# EAGLE schematic motor_power_avr (EAGLE 4.16)
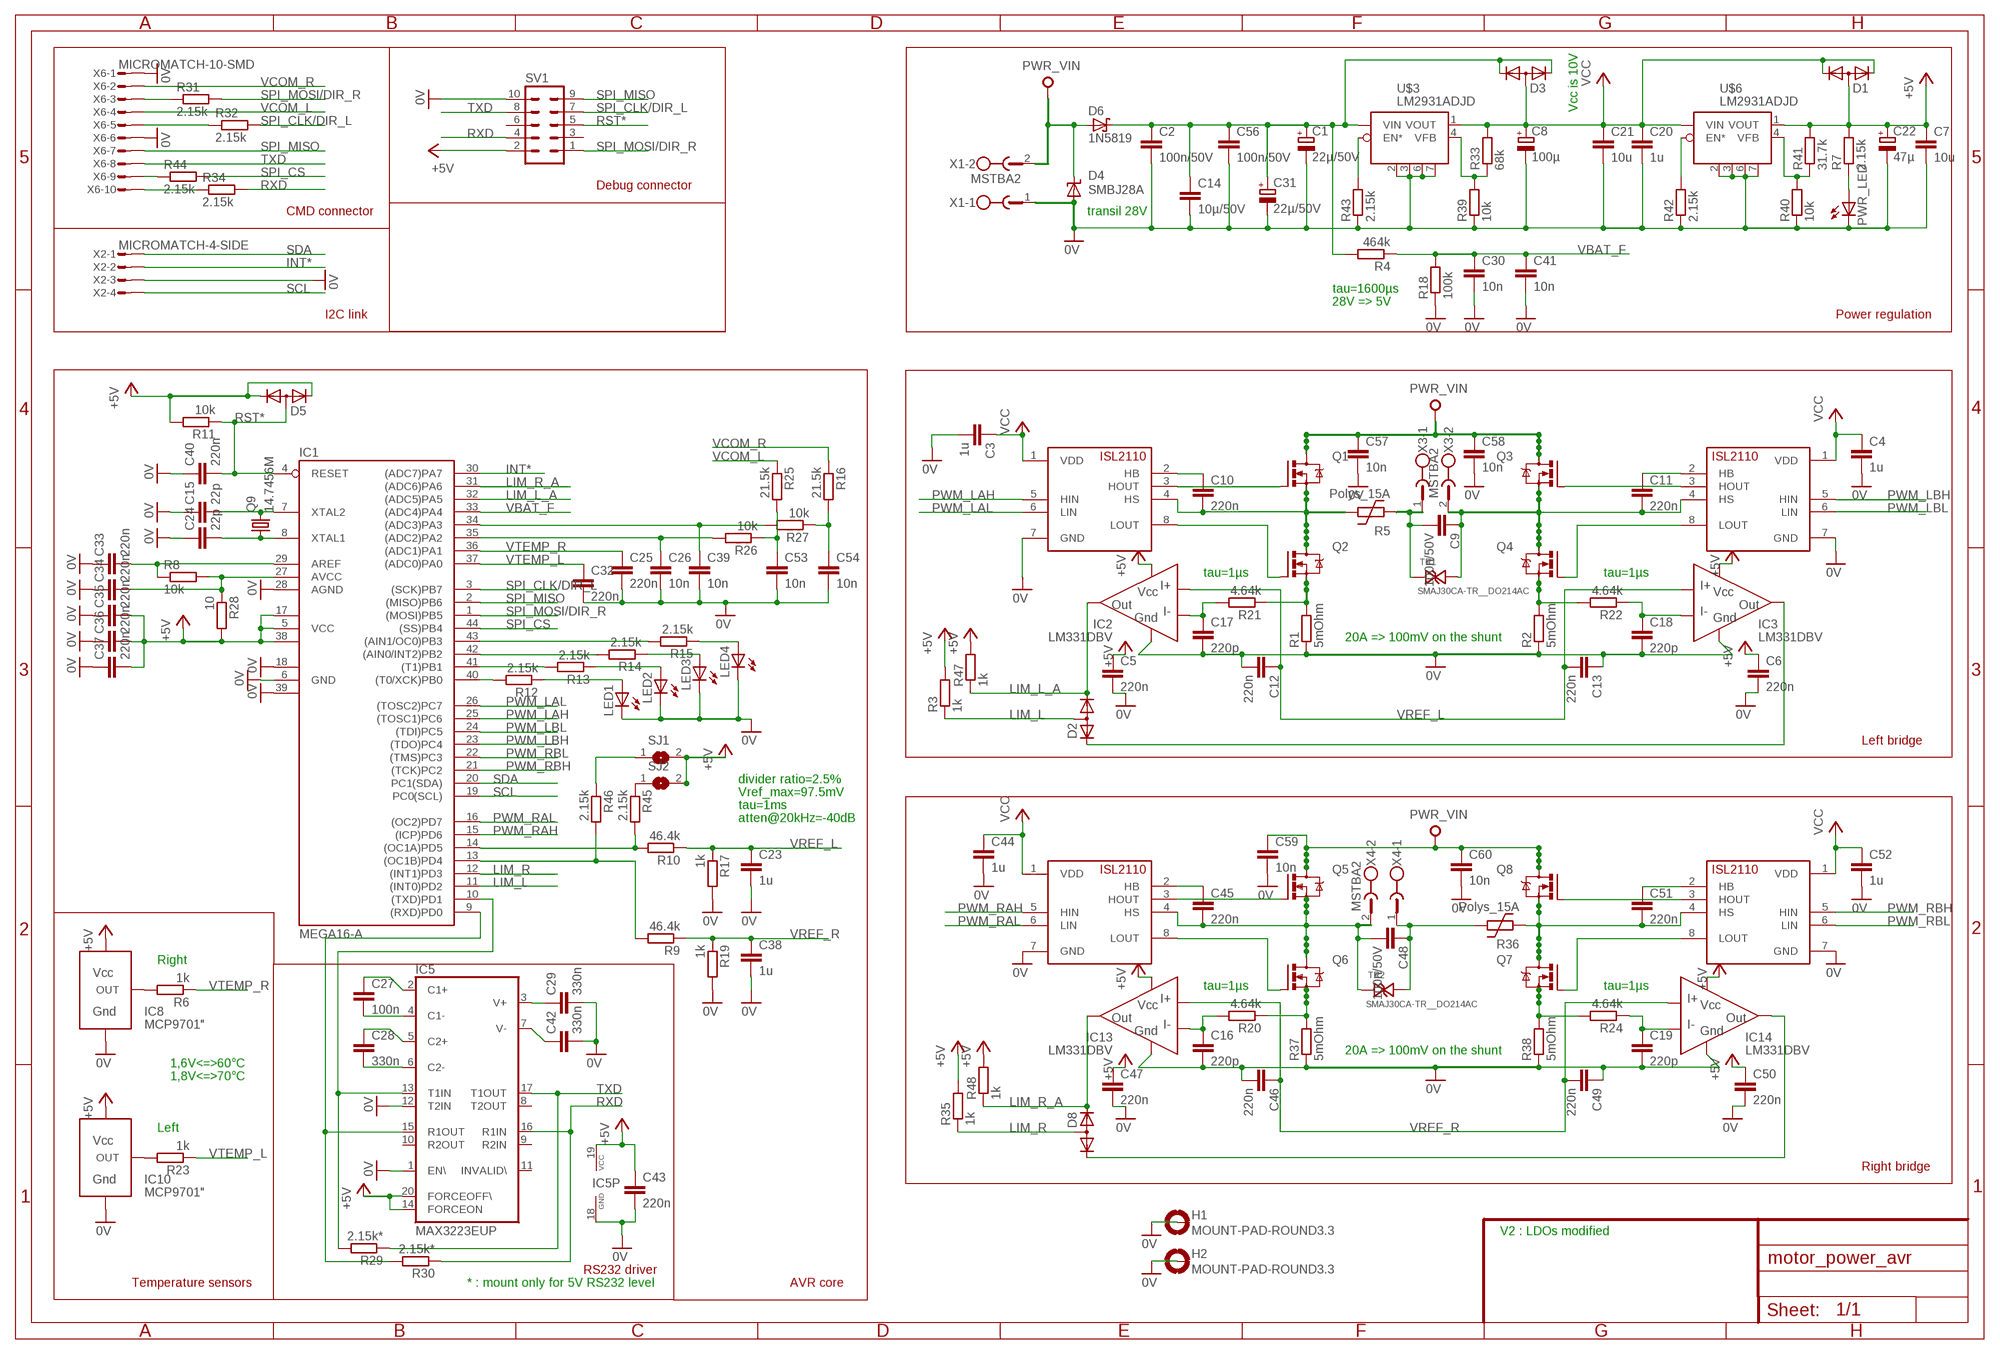
[diagram p0: schematic, sheet 1]

## Parts
C1  22µ/50V  CPOL-EUE  [PANASONIC_E]
C2  100n/50V  C-EUC0805  [C0805]
C3  1u  C-EU0603_SMALL  [0603_SMALL]
C4  1u  C-EU0603_SMALL  [0603_SMALL]
C5  220n  C-EU0603_SMALL  [0603_SMALL]
C6  220n  C-EU0603_SMALL  [0603_SMALL]
C7  10u  C-EU0603_SMALL  [0603_SMALL]
C8  100µ  CPOL-EUE  [PANASONIC_E]
C9  100n/50V  C-EUC0805  [C0805]
C10  220n  C-EU0603_SMALL  [0603_SMALL]
C11  220n  C-EU0603_SMALL  [0603_SMALL]
C12  220n  C-EU0603_SMALL  [0603_SMALL]
C13  220n  C-EU0603_SMALL  [0603_SMALL]
C14  10µ/50V  C-EUC2220K  [C2220K]
C15  22p  C-EU0603_SMALL  [0603_SMALL]
C16  220p  C-EU0603_SMALL  [0603_SMALL]
C17  220p  C-EU0603_SMALL  [0603_SMALL]
C18  220p  C-EU0603_SMALL  [0603_SMALL]
C19  220p  C-EU0603_SMALL  [0603_SMALL]
C20  1u  C-EU0603_SMALL  [0603_SMALL]
C21  10u  C-EU0603_SMALL  [0603_SMALL]
C22  47µ  CPOL-EUE  [PANASONIC_E]
C23  1u  C-EU0603_SMALL  [0603_SMALL]
C24  22p  C-EU0603_SMALL  [0603_SMALL]
C25  220n  C-EU0603_SMALL  [0603_SMALL]
C26  10n  C-EU0603_SMALL  [0603_SMALL]
C27  100n  C-EU0603_SMALL  [0603_SMALL]
C28  330n  C-EU0603_SMALL  [0603_SMALL]
C29  330n  C-EU0603_SMALL  [0603_SMALL]
C30  10n  C-EU0603_SMALL  [0603_SMALL]
C31  22µ/50V  CPOL-EUE  [PANASONIC_E]
C32  220n  C-EU0603_SMALL  [0603_SMALL]
C33  220n  C-EU0603_SMALL  [0603_SMALL]
C34  220n  C-EU0603_SMALL  [0603_SMALL]
C35  220n  C-EUC0603  [C0603]
C36  220n  C-EUC0603  [C0603]
C37  220n  C-EUC0603  [C0603]
C38  1u  C-EU0603_SMALL  [0603_SMALL]
C39  10n  C-EU0603_SMALL  [0603_SMALL]
C40  220n  C-EU0603_SMALL  [0603_SMALL]
C41  10n  C-EU0603_SMALL  [0603_SMALL]
C42  330n  C-EU0603_SMALL  [0603_SMALL]
C43  220n  C-EU0603_SMALL  [0603_SMALL]
C44  1u  C-EU0603_SMALL  [0603_SMALL]
C45  220n  C-EU0603_SMALL  [0603_SMALL]
C46  220n  C-EU0603_SMALL  [0603_SMALL]
C47  220n  C-EU0603_SMALL  [0603_SMALL]
C48  100n/50V  C-EUC0805  [C0805]
C49  220n  C-EU0603_SMALL  [0603_SMALL]
C50  220n  C-EU0603_SMALL  [0603_SMALL]
C51  220n  C-EU0603_SMALL  [0603_SMALL]
C52  1u  C-EU0603_SMALL  [0603_SMALL]
C53  10n  C-EU0603_SMALL  [0603_SMALL]
C54  10n  C-EU0603_SMALL  [0603_SMALL]
C56  100n/50V  C-EUC0805  [C0805]
C57  10n  C-EU0603_SMALL  [0603_SMALL]
C58  10n  C-EU0603_SMALL  [0603_SMALL]
C59  10n  C-EU0603_SMALL  [0603_SMALL]
C60  10n  C-EU0603_SMALL  [0603_SMALL]
D1  DIODE-2CA|ACSOT23  [SOT23]
D2  DIODE-2CA|ACSOT23  [SOT23]
D3  DIODE-2CA|ACSOT23  [SOT23]
D4  SMBJ28A  SUPPRESSOR-SMBJ  [SMBJ]
D5  DIODE-2CA|ACSOT23  [SOT23]
D6  1N5819  SCHOTTKY-DIODEDO35-7  [DO35-7]
D8  DIODE-2CA|ACSOT23  [SOT23]
H1  MOUNT-PAD-ROUND3.3  [3,3-PAD]
H2  MOUNT-PAD-ROUND3.3  [3,3-PAD]
IC1  MEGA16-A  [TQFP44]
IC2  LM331DBV  [SOT23-6]
IC3  LM331DBV  [SOT23-6]
IC5  MAX3223EUP  [TSSOP20]
IC8  MCP9701"  [SOT363-5]
IC10  MCP9701"  [SOT363-5]
IC13  LM331DBV  [SOT23-6]
IC14  LM331DBV  [SOT23-6]
LED1  LEDSMT1206  [1206]
LED2  LEDSMT1206  [1206]
LED3  LEDSMT1206  [1206]
LED4  LEDSMT1206  [1206]
PWR_LED  LEDSMT1206  [1206]
Q1  N-MOSFET-SO8S  [SO-08]
Q2  N-MOSFET-SO8S  [SO-08]
Q3  N-MOSFET-SO8S  [SO-08]
Q4  N-MOSFET-SO8S  [SO-08]
Q5  N-MOSFET-SO8S  [SO-08]
Q6  N-MOSFET-SO8S  [SO-08]
Q7  N-MOSFET-SO8S  [SO-08]
Q8  N-MOSFET-SO8S  [SO-08]
Q9  14.7456M  CRYSTALHC49U70  [HC49U70]
R1  5mOhm  R-EU_R2512  [R2512]
R2  5mOhm  R-EU_R2512  [R2512]
R3  1k  R-EU_0603_SMALL  [0603_SMALL]
R4  464k  R-EU_R0603  [R0603]
R5  Polys_15A  POLYSWITCH_0207/10  [0207/10]
R6  1k  R-EU_0603_SMALL  [0603_SMALL]
R7  2.15k  R-EU_0603_SMALL  [0603_SMALL]
R8  10k  R-EU_0603_SMALL  [0603_SMALL]
R9  46.4k  R-EU_0603_SMALL  [0603_SMALL]
R10  46.4k  R-EU_0603_SMALL  [0603_SMALL]
R11  10k  R-EU_0603_SMALL  [0603_SMALL]
R12  2.15k  R-EU_0603_SMALL  [0603_SMALL]
R13  2.15k  R-EU_0603_SMALL  [0603_SMALL]
R14  2.15k  R-EU_0603_SMALL  [0603_SMALL]
R15  2.15k  R-EU_0603_SMALL  [0603_SMALL]
R16  21.5k  R-EU_0603_SMALL  [0603_SMALL]
R17  1k  R-EU_R0603  [R0603]
R18  100k  R-EU_R0603  [R0603]
R19  1k  R-EU_R0603  [R0603]
R20  4.64k  R-EU_0603_SMALL  [0603_SMALL]
R21  4.64k  R-EU_0603_SMALL  [0603_SMALL]
R22  4.64k  R-EU_0603_SMALL  [0603_SMALL]
R23  1k  R-EU_0603_SMALL  [0603_SMALL]
R24  4.64k  R-EU_0603_SMALL  [0603_SMALL]
R25  21.5k  R-EU_0603_SMALL  [0603_SMALL]
R26  10k  R-EU_0603_SMALL  [0603_SMALL]
R27  10k  R-EU_0603_SMALL  [0603_SMALL]
R28  10  R-EU_0603_SMALL  [0603_SMALL]
R29  2.15k*  R-EU_0603_SMALL  [0603_SMALL]
R30  2.15k*  R-EU_0603_SMALL  [0603_SMALL]
R31  2.15k  R-EU_0603_SMALL  [0603_SMALL]
R32  2.15k  R-EU_0603_SMALL  [0603_SMALL]
R33  68k  R-EU_R0603  [R0603]
R34  2.15k  R-EU_0603_SMALL  [0603_SMALL]
R35  1k  R-EU_0603_SMALL  [0603_SMALL]
R36  Polys_15A  POLYSWITCH_0207/10  [0207/10]
R37  5mOhm  R-EU_R2512  [R2512]
R38  5mOhm  R-EU_R2512  [R2512]
R39  10k  R-EU_R0603  [R0603]
R40  10k  R-EU_R0603  [R0603]
R41  31.7k  R-EU_R0603  [R0603]
R42  2.15k  R-EU_R0603  [R0603]
R43  2.15k  R-EU_R0603  [R0603]
R44  2.15k  R-EU_0603_SMALL  [0603_SMALL]
R45  2.15k  R-EU_0603_SMALL  [0603_SMALL]
R46  2.15k  R-EU_0603_SMALL  [0603_SMALL]
R47  1k  R-EU_0603_SMALL  [0603_SMALL]
R48  1k  R-EU_0603_SMALL  [0603_SMALL]
SJ1  SJ  [SJ]
SJ2  SJ  [SJ]
SV1  ML10L  [ML10L]
TR1  SMAJ30CA-TR__DO214AC  [DO214AC_BIDIR]
TR2  SMAJ30CA-TR__DO214AC  [DO214AC_BIDIR]
U$1  ISL2110SOIC  [SO08]
U$2  ISL2110SOIC  [SO08]
U$3  LM2931ADJD  [SO08]
U$6  LM2931ADJD  [SO08]
U$17  ISL2110SOIC  [SO08]
U$18  ISL2110SOIC  [SO08]
X1  MSTBA2  [MSTBA2]
X2  MICROMATCH-4-SIDE  [MICROMATCH-4-SIDE]
X3  MSTBA2  [MSTBA2]
X4  MSTBA2  [MSTBA2]
X6  MICROMATCH-10-SMD  [MICROMATCH-10-SMD]

## Nets
0V: C1.- C2.2 C3.2 C4.2 C5.2 C6.2 C7.2 C8.- C12.2 C13.1 C14.2 C15.1 C16.2 C17.2 C18.2 C19.2 C20.2 C21.2 C22.- C23.2 C24.1 C25.2 C26.2 C29.2 C30.2 C31.- C32.2 C33.1 C34.1 C35.1 C36.1 C37.1 C38.2 C39.2 C40.1 C41.2 C42.2 C43.2 C44.2 C46.2 C47.2 C49.1 C50.2 C52.2 C53.2 C54.2 C56.2 C57.2 C58.2 C59.2 C60.2 D4.A H1.B3,3(MOUNT) H2.B3,3(MOUNT) IC1.6(GND) IC1.18(GND1) IC1.28(AGND) IC1.39(GND2) IC2.2(VSS) IC3.2(VSS) IC5.1(EN\) IC5.12(T2IN) IC5.18(GND) IC8.2(GND) IC10.2(GND) IC13.2(VSS) IC14.2(VSS) LED1.C LED2.C LED3.C LED4.C PWR_LED.C R1.1 R2.1 R17.2 R18.1 R19.2 R37.1 R38.1 R39.1 R40.1 R42.1 R43.1 SV1.10 U$1.7(GND) U$2.7(GND) U$3.2(GND1) U$3.3(GND2) U$3.6(GND3) U$3.7(GND4) U$6.2(GND1) U$6.3(GND2) U$6.6(GND3) U$6.7(GND4) U$17.7(GND) U$18.7(GND) X1.1 X2.3 X6.1 X6.6
+5V: C5.1 C6.1 C7.1 C22.+ C35.2 C36.2 C37.2 C43.1 C47.1 C50.1 D1.3(A) D5.1(K1) D5.2(K2) IC1.5(VCC) IC1.17(VCC1) IC1.38(VCC2) IC2.6(VCC) IC3.6(VCC) IC5.14(FORCEON) IC5.19(VCC) IC5.20(FORCEOFF\) IC8.4(VCC) IC10.4(VCC) IC13.6(VCC) IC14.6(VCC) R3.2 R7.2 R11.2 R28.2 R35.2 R41.2 R47.2 R48.2 SJ1.2 SJ2.2 SV1.2 U$6.1(VOUT)
INT*: IC1.30((ADC7)PA7) X2.2
LIM_L: D2.3(A) IC1.11((INT0)PD2) R3.1
LIM_L_A: D2.1(K1) IC1.32((ADC5)PA5) IC2.4(OUT) R47.1
LIM_L_B: D2.2(K2) IC3.4(OUT)
LIM_R: D8.3(A) IC1.12((INT1)PD3) R35.1
LIM_R_A: D8.2(K2) IC1.31((ADC6)PA6) IC13.4(OUT) R48.1
LIM_R_B: D8.1(K1) IC14.4(OUT)
N$1: C15.2 IC1.7(XTAL2) Q9.2
N$2: C24.2 IC1.8(XTAL1) Q9.1
N$3: IC8.3(OUT) R6.2
N$4: C1.+ C2.1 C14.1 C31.+ C56.1 D3.1(K1) D3.2(K2) D6.C R4.2 U$3.8(VIN)
N$5: C33.2 IC1.29(AREF) R8.1
N$6: LED2.A R13.1
N$7: C34.2 IC1.27(AVCC) R8.2 R28.1
N$8: Q1.4(G) U$1.3(HOUT)
N$9: C51.2 Q7.5(D) Q7.6(D) Q7.7(D) Q7.8(D) Q8.1(S) Q8.2(S) Q8.3(S) R36.1 U$17.4(HS)
N$10: C45.2 C48.2 Q5.1(S) Q5.2(S) Q5.3(S) Q6.5(D) Q6.6(D) Q6.7(D) Q6.8(D) TR2.P$1 U$18.4(HS) X4.2
N$11: Q2.1(S) Q2.2(S) Q2.3(S) R1.2 R21.1
N$12: IC1.14((OC1A)PD5) R10.2 R45.2
N$13: PWR_LED.A R7.1
N$14: IC1.13((OC1B)PD4) R9.2 R46.2
N$15: LED3.A R14.1
N$16: C10.1 U$1.2(HB)
N$17: LED4.A R15.1
N$18: Q2.4(G) U$1.8(LOUT)
N$19: IC1.43((AIN1/OC0)PB3) R15.2
N$20: Q3.4(G) U$2.3(HOUT)
N$21: R34.1 X6.10
N$22: IC1.40((T0/XCK)PB0) R12.2
N$23: IC1.41((T1)PB1) R13.2
N$24: IC1.42((AIN0/INT2)PB2) R14.2
N$25: R40.2 R41.1 U$6.4(VFB)
N$26: LED1.A R12.1
N$27: R33.1 R39.2 U$3.4(VFB)
N$28: R43.2 U$3.5(EN*)
N$29: R42.2 U$6.5(EN*)
N$30: R44.1 X6.9
N$31: R46.1 SJ1.1
N$32: C27.2 IC5.4(C1-)
N$33: C16.1 IC13.3(I-) R20.2
N$34: C17.1 IC2.3(I-) R21.2
N$35: C18.1 IC3.3(I-) R22.1
N$36: C19.1 IC14.3(I-) R24.1
N$37: C28.2 IC5.6(C2-)
N$38: C9.1 C11.2 Q3.1(S) Q3.2(S) Q3.3(S) Q4.5(D) Q4.6(D) Q4.7(D) Q4.8(D) TR1.P$2 U$2.4(HS) X3.2
N$39: Q4.1(S) Q4.2(S) Q4.3(S) R2.2 R22.2
N$40: C11.1 U$2.2(HB)
N$41: Q4.4(G) U$2.8(LOUT)
N$42: C28.1 IC5.5(C2+)
N$43: C27.1 IC5.2(C1+)
N$44: C29.1 IC5.3(V+)
N$45: C42.1 IC5.7(V-)
N$46: IC1.9((RXD)PD0) IC5.15(R1OUT) R30.2
N$47: IC1.10((TXD)PD1) IC5.13(T1IN) R29.2
N$48: C54.1 R16.2 R27.1
N$49: C53.1 R25.2 R26.1
N$50: IC10.3(OUT) R23.2
N$51: R45.1 SJ2.1
N$52: C39.1 IC1.34((ADC3)PA3) R27.2
N$53: C26.1 IC1.35((ADC2)PA2) R26.2
N$55: R31.1 X6.3
N$56: R32.1 X6.5
N$67: C10.2 Q1.1(S) Q1.2(S) Q1.3(S) Q2.5(D) Q2.6(D) Q2.7(D) Q2.8(D) R5.2 U$1.4(HS)
N$69: Q6.1(S) Q6.2(S) Q6.3(S) R20.1 R37.2
N$72: C45.1 U$18.2(HB)
N$73: C48.1 R36.2 TR2.P$2 X4.1
N$74: Q6.4(G) U$18.8(LOUT)
N$77: Q7.1(S) Q7.2(S) Q7.3(S) R24.2 R38.2
N$78: Q8.4(G) U$17.3(HOUT)
N$79: C9.2 R5.1 TR1.P$1 X3.1
N$81: C51.1 U$17.2(HB)
N$82: Q7.4(G) U$17.8(LOUT)
N$87: Q5.4(G) U$18.3(HOUT)
PWM_LAH: IC1.25((TOSC1)PC6) U$1.5(HIN)
PWM_LAL: IC1.26((TOSC2)PC7) U$1.6(LIN)
PWM_LBH: IC1.23((TDO)PC4) U$2.5(HIN)
PWM_LBL: IC1.24((TDI)PC5) U$2.6(LIN)
PWM_RAH: IC1.15((ICP)PD6) U$18.5(HIN)
PWM_RAL: IC1.16((OC2)PD7) U$18.6(LIN)
PWM_RBH: IC1.21((TCK)PC2) U$17.5(HIN)
PWM_RBL: IC1.22((TMS)PC3) U$17.6(LIN)
PWR_VIN: C57.1 C58.1 C59.1 C60.1 D4.C D6.A Q1.5(D) Q1.6(D) Q1.7(D) Q1.8(D) Q3.5(D) Q3.6(D) Q3.7(D) Q3.8(D) Q5.5(D) Q5.6(D) Q5.7(D) Q5.8(D) Q8.5(D) Q8.6(D) Q8.7(D) Q8.8(D) X1.2
RST*: C40.2 D5.3(A) IC1.4(RESET) R11.1 SV1.5
RXD: IC5.16(R1IN) R30.1 R34.2 SV1.4
SCL: IC1.19(PC0(SCL)) X2.4
SDA: IC1.20(PC1(SDA)) X2.1
SPI_CLK/DIR_L: IC1.3((SCK)PB7) R32.2 SV1.7
SPI_CS: IC1.44((SS)PB4) R44.2
SPI_MISO: IC1.2((MISO)PB6) SV1.9 X6.7
SPI_MOSI/DIR_R: IC1.1((MOSI)PB5) R31.2 SV1.1
TXD: IC5.17(T1OUT) R29.1 SV1.8 X6.8
VBAT_F: C30.1 C41.1 IC1.33((ADC4)PA4) R4.1 R18.2
VCC [5A]: C3.1 C4.1 C8.+ C20.1 C21.1 C44.1 C52.1 D1.1(K1) D1.2(K2) D3.3(A) R33.2 U$1.1(VDD) U$2.1(VDD) U$3.1(VOUT) U$6.8(VIN) U$17.1(VDD) U$18.1(VDD)
VCOM_L: R25.1 X6.4
VCOM_R: R16.1 X6.2
VREF_L: C12.1 C13.2 C23.1 IC2.1(I+) IC3.1(I+) R10.1 R17.1
VREF_R: C38.1 C46.1 C49.2 IC13.1(I+) IC14.1(I+) R9.1 R19.1
VTEMP_L: C32.1 IC1.37((ADC0)PA0) R23.1
VTEMP_R: C25.1 IC1.36((ADC1)PA1) R6.1
Unconnected: IC5.8(T2OUT) IC5.9(R2IN) IC5.10(R2OUT) IC5.11(INVALID\) SV1.3 SV1.6

## Notes on the sheet
- Vcc is 10V
- Debug connector
- CMD connector | transil 28V
- tau=1600µs
- 28V => 5V
- I2C link | Power regulation
- tau=1µs | tau=1µs
- 20A => 100mV on the shunt
- Left bridge
- divider ratio=2.5%
- Vref_max=97.5mV
- tau=1ms
- atten@20kHz=-40dB
- Right
- tau=1µs | tau=1µs
- 20A => 100mV on the shunt
- 1,6V<=>60°C
- 1,8V<=>70°C
- Left
- Right bridge
- V2 : LDOs modified
- RS232 driver
- Temperature sensors | * : mount only for 5V RS232 level | AVR core

## Library data of the parts
C1 C8 C22 C31 = rcl:CPOL-EU: POLARIZED CAPACITOR, European symbol
C2-C7 C9-C21 C23-C30 C32-C54 C56-C60 = rcl:C-EU: CAPACITOR, European symbol
D1-D3 D5 D8 = diode:DIODE-2CA|AC: Dual DIODE Cathode-Anode|Anode-Cathode
D4 = diode:SUPPRESSOR-: Suppressor diode
D6 = diode:SCHOTTKY-DIODE: Schottky Diode
H1 H2 = holes:MOUNT-PAD-ROUND: MOUNTING PAD, round
IC1 = atmel:MEGA16: MICROCONTROLLER 16 Kbytes FLASH 1 kbytes SRAM 512 bytes EEPROM USART 8-channel 10 bit ADC Source: avr.lbr
IC2 IC3 IC13 IC14 = robot:LM331
IC5 = maxim:MAX3223*: RS-232 Transceivers with AutoShutdown 1µA Supply-Current, True +3V to +5.5V http://dbserv.maxim-ic.com/
IC8 IC10 = robot:MCP9701
LED1-LED4 PWR_LED = led:LED: LED OSRAM: - CHIPLED LG R971, LG N971, LY N971, LG Q971, LY Q971, LO R971, LY R971 LH N974, LH R974 LS Q976, LO Q976, LY Q976 LO Q996 - Hyper CHIPLED LW Q18S LB Q993, LB Q99A, LB R99A - SideLED LS A670, LO A670, LY A670, LG A670, LP A670 LB A673, LV A673, LT A673, LW A673 LH A674 LY A675 LS A676, LA A676, LO A676, LY A676, LW A676 LS A679, LY A679, LG A679 - Hyper Micro SIDELED® LS Y876, LA Y876, LO Y876, LY Y876 LT Y87S - SmartLED LW L88C, LW L88S LB L89C, LB L89S, LG L890 LS L89K, LO L89K, LY L89K LS L896, LA L896, LO L896, LY L896 - TOPLED LS T670, LO T670, LY T670, LG T670, LP T670 LSG T670, LSP T670, LSY T670, LOP T670, LYG T670 LG T671, LOG T671, LSG T671 LB T673, LV T673, LT T673, LW T673 LH T674 LS T676, LA T676, LO T676, LY T676, LB T676, LH T676, LSB T676, LW T676 LB T67C, LV T67C, LT T67C, LS T67K, LO T67K, LY T67K, LW E67C LS E67B, LA E67B, LO E67B, LY E67B, LB E67C, LV E67C, LT E67C LW T67C LS T679, LY T679, LG T679 LS T770, LO T770, LY T770, LG T770, LP T770 LB T773, LV T773, LT T773, LW T773 LH T774 LS E675, LA E675, LY E675, LS T675 LS T776, LA T776, LO T776, LY T776, LB T776 LHGB T686 LT T68C, LB T68C - Hyper Mini TOPLED® LB M676 - Mini TOPLED Santana® LG M470 LS M47K, LO M47K, LY M47K Source: http://www.osram.convergy.de/
Q1-Q8 = transistor-power:N-MOSFET-SO8: N-Channel MOSFET Example: FDS7760A; N-Channel Logic Level PowerTrench® MOSFET FDS2572; N-Channel UltraFET® Trench MOSFET Source: www.fairchildsemi.com
Q9 = crystal:CRYSTAL: CRYSTAL
R1-R4 R6-R35 R37-R48 = rcl:R-EU_: RESISTOR, European symbol
R5 R36 = apbteam_polyswitch:POLYSWITCH_: POLYSWITCH
SJ1 SJ2 = jumper:SJ: SMD solder JUMPER
SV1 = con-harting-ml:ML10: HARTING
TR1 TR2 = transil:SMAJ30CA-TR__DO214AC: Transil SMAJ 30 Volt BIDIR. DO214AC Package.
U$1 U$2 U$17 U$18 = robot:ISL2110
U$3 U$6 = robot:LM2931ADJ
X1 X3 X4 = con-phoenix-508:MSTBA2: PHOENIX
X2 = apbteam_con-amp-micromatch:MICROMATCH-4: MicroMaTch 4
X6 = apbteam_con-amp-micromatch:MICROMATCH-10: MicroMaTch 10